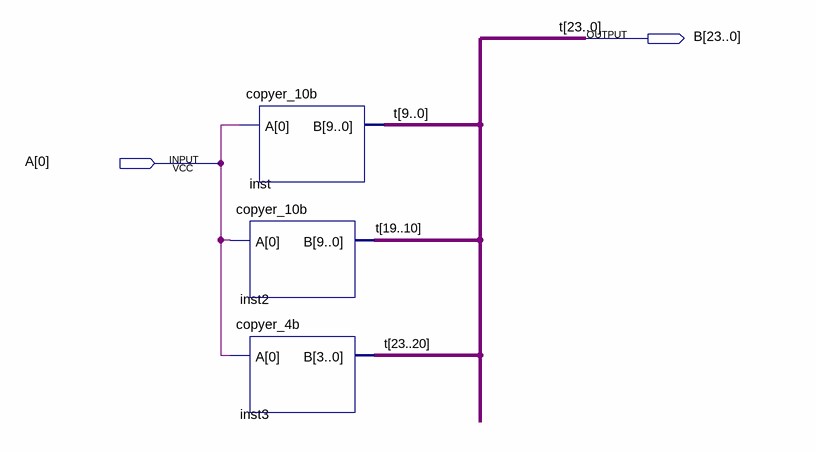
[diagram p0: schematic sheet]
// Quartus schematic copyer_24b.bdf as structural Verilog: 3 symbols, 2 pins
module copyer_24b (
  input  [0:0] A,
  output [23:0] B
);

  copyer_10b inst (.A(A[0]), .B(B[9:0]));
  copyer_10b inst2 (.A(A[0]), .B(B[19:10]));
  copyer_4b inst3 (.A(A[0]), .B(B[23:20]));

  // Other names for the same wires on the sheet: t[23:0] = B
endmodule
